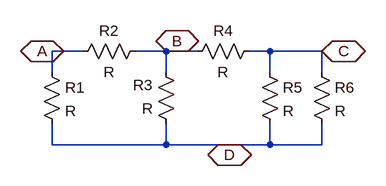
[diagram p0: schematic exer2_02.asc]
exer2_02.asc, the LTspice schematic file:
Version 4
SHEET 1 880 680
WIRE 80 80 32 80
WIRE 208 80 160 80
WIRE 256 80 208 80
WIRE 368 80 336 80
WIRE 448 80 368 80
WIRE 32 112 32 80
WIRE 208 112 208 80
WIRE 368 112 368 80
WIRE 448 112 448 80
WIRE 32 224 32 192
WIRE 208 224 208 192
WIRE 208 224 32 224
WIRE 368 224 368 192
WIRE 368 224 208 224
WIRE 448 224 448 192
WIRE 448 224 368 224
FLAG -16 80 A
IOPIN -16 80 BiDir
FLAG 192 64 B
IOPIN 192 64 BiDir
FLAG 448 80 C
IOPIN 448 80 BiDir
FLAG 272 240 D
IOPIN 272 240 BiDir
SYMBOL res 16 96 R0
SYMATTR InstName R1
SYMBOL res 176 64 R90
WINDOW 0 0 56 VBottom 2
WINDOW 3 32 56 VTop 2
SYMATTR InstName R2
SYMBOL res 224 208 R180
WINDOW 0 36 76 Left 2
WINDOW 3 36 40 Left 2
SYMATTR InstName R3
SYMBOL res 240 96 R270
WINDOW 0 32 56 VTop 2
WINDOW 3 0 56 VBottom 2
SYMATTR InstName R4
SYMBOL res 352 96 R0
SYMATTR InstName R5
SYMBOL res 432 96 R0
SYMATTR InstName R6

The netlist it stands for:
* exer2_02.asc
R1 N001 N003 R
R2 N002 N001 R
R3 N003 N002 R
R4 N002 C R
R5 C N003 R
R6 C N003 R
.backanno
.end